# Altium schematic sheet 03_CONNECTORS & AUDIO CONTROL INPUTS.SchDoc
size A4
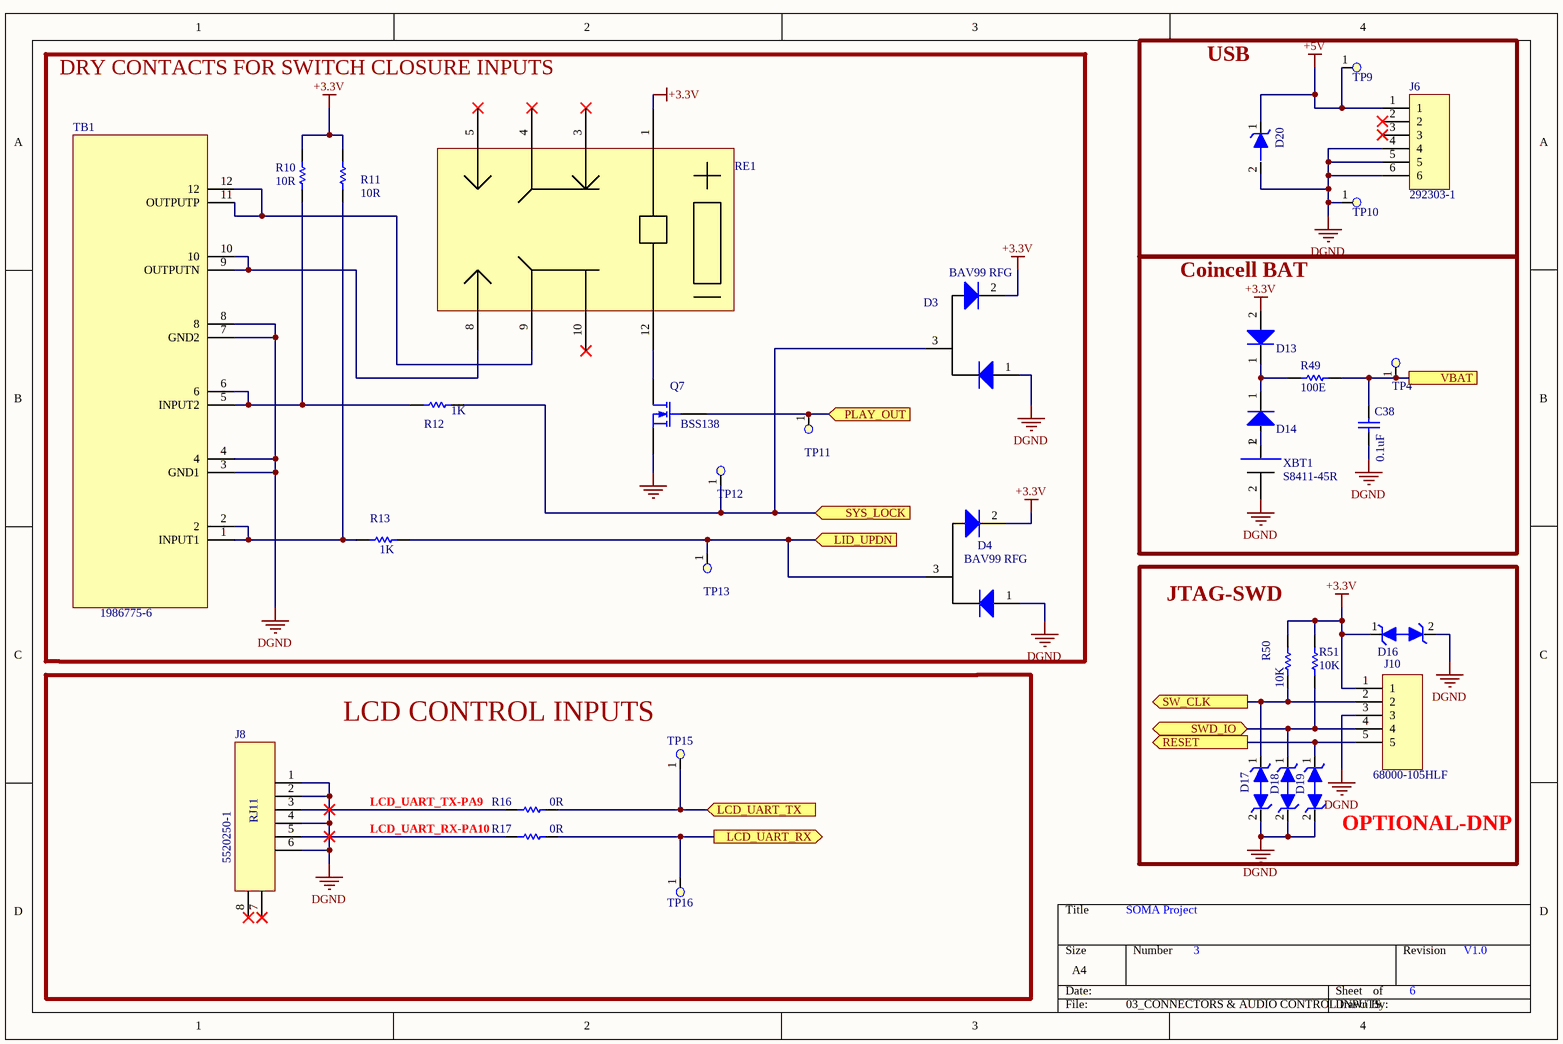
[diagram p0: 03_CONNECTORS & AUDIO CONTROL INPUTS.SchDoc]

## Parts
C38  0.1uF  [C0603]
D3  value BAV99 RFG  [SOT95P240X130-3N]  (hidden comment: DIODE ARRAY GP 70V 200MA SOT23)
D4  value BAV99 RFG  [SOT95P240X130-3N]  (hidden comment: DIODE ARRAY GP 70V 200MA SOT23)
D13  DIODE SCHOTTKY 30V 200MA SOD123  [SOD3715X140N_2A]  (value not drawn)
D14  DIODE SCHOTTKY 30V 200MA SOD123  [SOD3715X140N_2A]  (value not drawn)
D16  TVS DIODE 3.3VWM 11.5VC SOD923  [SOD1006X40N_BI]  (value not drawn)
D17  TVS DIODE 3.3VWM 11.5VC SOD923  [SOD1006X40N_BI]  (value not drawn)
D18  TVS DIODE 3.3VWM 11.5VC SOD923  [SOD1006X40N_BI]  (value not drawn)
D19  TVS DIODE 3.3VWM 11.5VC SOD923  [SOD1006X40N_BI]  (value not drawn)
D20  TVS DIODE 5VWM 12VC SOD723  [SOD1460X65N_2A]  (value not drawn)
J6  value 292303-1  [TE_292303-1]  (hidden comment: CONN RCPT USB2.0 TYPEA 4POS R/A)
J8  Manufacturer Part Number: 5520250-1  [TE_5520250-1]  (hidden comment: CONN MOD JACK 6P2C R/A UNSHLD)
J10  value 68000-105HLF  [BERG_1X5]  (hidden comment: CONN HEADER VERT 5POS 2.54MM)
Q7  value BSS138  [SOT95P240X110-3N]  (hidden comment: MOSFET N-CH 50V 220MA SOT23-3)
R10  value 10R  [R0402]  (hidden comment: RES SMD 10 OHM 5% 1/16W 0402)
R11  value 10R  [R0402]  (hidden comment: RES SMD 10 OHM 5% 1/16W 0402)
R12  value 1K  [R0402]  (hidden comment: RES SMD 1K OHM 1% 1/16W 0402)
R13  value 1K  [R0402]  (hidden comment: RES SMD 1K OHM 1% 1/16W 0402)
R16  value 0R  [R0402]  (hidden comment: RES SMD 0 OHM JUMPER 1/16W 0402)
R17  value 0R  [R0402]  (hidden comment: RES SMD 0 OHM JUMPER 1/16W 0402)
R49  100E  [R0402]
R50  10K  [R0402]
R51  10K  [R0402]
RE1  RELAY GEN PURPOSE DPDT 1A 3VDC  [RELAY_TXS2SA-3V]  (value not drawn)
TB1  Manufacturer Part Number: 1986775-6  [TE_1986775-6]  (hidden comment: TERM BLK 6P SIDE ENT 5.08MM PCB)
TP4  Test Point,1.6mm Diameter,SMD  [TP_63C]  (value not drawn)  (no BOM)
TP9  Test Point,1.6mm Diameter,SMD  [TP_63C]  (value not drawn)  (no BOM)
TP10  Test Point,1.6mm Diameter,SMD  [TP_63C]  (value not drawn)  (no BOM)
TP11  Test Point,1.6mm Diameter,SMD  [TP_63C]  (value not drawn)  (no BOM)
TP12  Test Point,1.6mm Diameter,SMD  [TP_63C]  (value not drawn)  (no BOM)
TP13  Test Point,1.6mm Diameter,SMD  [TP_63C]  (value not drawn)  (no BOM)
TP15  Test Point,1.6mm Diameter,SMD  [TP_63C]  (value not drawn)  (no BOM)
TP16  Test Point,1.6mm Diameter,SMD  [TP_63C]  (value not drawn)  (no BOM)
XBT1  Manufacturer part Number: S8411-45R  [HLDR_S8411-45R]  (hidden comment: BATTERY HOLDER COIN 12MM SMD)

## Blocks framed on the sheet
DRY CONTACTS FOR SWITCH CLOSURE INPUTS: D3 D4 Q7 R10-R13 RE1 TB1 TP11-TP13
USB: D20 J6 TP9 TP10
Coincell BAT: C38 D13 D14 R49 TP4 XBT1
LCD CONTROL INPUTS: J8 R16 R17 TP15 TP16

## Ports
LCD_UART_RX (out), LCD_UART_TX (in), LID_UPDN (in), PLAY_OUT (in), RESET (out), SW_CLK (out), SWD_IO (bidir), SYS_LOCK (in), VBAT

## Nets
+3.3V: D3.2(K) D4.2(K) D13.2(A) D16.1(K) J10.1 R10.2 R11.2 R50.2 R51.2 RE1.1
+5V: D20.1(K) J6.1 TP9.1
DGND: C38.1 D3.1(A) D4.1(A) D16.2(A) D17.2(A) D18.2(A) D19.2(A) D20.2(A) J6.4 J6.5 J6.6 J8.1 J8.2 J8.4 J8.6 J10.3 TB1.3(GND1) TB1.4 TB1.7(GND2) TB1.8 TP10.1 XBT1.2(-)
GND: Q7.2(S)
LCD_UART_RX: R17.2 TP16.1 ; port LCD_UART_RX
LCD_UART_RX-PA10: J8.5 R17.1
LCD_UART_TX: R16.2 TP15.1 ; port LCD_UART_TX
LCD_UART_TX-PA9: J8.3 R16.1
LID_UPDN: D4.3(AK) R13.2 TP13.1 ; port LID_UPDN
PLAY_OUT: Q7.1(G) TP11.1 ; port PLAY_OUT
RESET: D19.1(K) J10.5 ; port RESET
SW_CLK: D17.1(K) J10.2 R50.1 ; port SW_CLK
SWD_IO: D18.1(K) J10.4 R51.1 ; port SWD_IO
SYS_LOCK: D3.3(AK) R12.2 TP12.1 ; port SYS_LOCK
VBAT: C38.2 R49.2 TP4.1 ; port VBAT
NetD13_1: D13.1(K) D14.1(K) R49.1
NetD14_2: D14.2(A) XBT1.1(+)
NetQ7_3: Q7.3(D) RE1.12
NetR10_1: R10.1 R12.1 TB1.5(INPUT2) TB1.6
NetR11_1: R11.1 R13.1 TB1.1(INPUT1) TB1.2
NetRE1_8: RE1.8 TB1.9(OUTPUTN) TB1.10
NetRE1_9: RE1.9 TB1.11(OUTPUTP) TB1.12

Not connected (* = marked no-connect by the designer): J6 2* 3*; J8 7* 8*; RE1 3* 4* 5* 10*

## Notes on the sheet
- JTAG-SWD
- (near D19) OPTIONAL-DNP
- SOMA Project
- 3
- 6
- V1.0
- (in symbol CONN MOD JACK 6P2C R/A UNSHLD) RJ11

## Library data of the parts
C38 = CAP CER 0.1UF 10V X7R 0603: Manufacturer: Würth Elektronik; Manufacturer part Number: 885012206020; Tolerance: ±10%; Operating Temperature: -55°C ~ 125°C; Reference link: https://www.digikey.com/en/products/detail/w%C3%BCrth-elektronik/885012206020/5453794; Package: 0603 (1608 Metric); Distributor: Digikey; Distributor part Number: 732-7939-1-ND; Type: CAP; Unit Price: $0.10000; Value: 0.1uF; Rating: 10V
D3 D4 = DIODE ARRAY GP 70V 200MA SOT23: Diode Array 1 Pair Series Connection Standard 70V 200mA Surface Mount TO-236-3, SC-59, SOT-23-3; Manufacturer: Taiwan Semiconductor Corporation; Type: Diodes - Rectifiers - Arrays; Operating Temperature: -55°C ~ 150°C; Package: TO-236-3, SC-59, SOT-23-3; Distributor: Digi-key; Reference link: https://www.digikey.in/product-detail/en/taiwan-semiconductor-corporation/BAV99-RFG/BAV99RFGTR-ND/7374190; Distributor part Number: BAV99RFGTR-ND; Unit Price: 2.46926; Rating: 70V 200mA; Part Status: Active
D13 D14 = DIODE SCHOTTKY 30V 200MA SOD123: Manufacturer: Diodes Incorporated; Manufacturer part Number: BAT43W-7-F; Value: 30 V 200mA (DC); Type: Schottky Diode; Rating: 1 V @ 200 mA; Tolerance: NA; Operating Temperature: -55°C ~ 125°C; Package: SOD-123; Reference link: https://www.digikey.com/en/products/detail/diodes-incorporated/BAT43W-7-F/749953; Distributor: Digikey; Distributor part Number: BAT43W-FDICT-ND; Unit Price: $0.50000
D16-D19 = TVS DIODE 3.3VWM 11.5VC SOD923: 11.5V Clamp 2A (8/20µs) Ipp Tvs Diode Surface Mount SOD-923; Manufacturer Part Number: ESD9B3.3ST5G; Manufacturer: ON Semiconductor; Value: 3.3V 11.5V; Assembly Option: DNP; Tolerance: NA; Operating Temperature: -55°C to +150°C; Distributor: Digikey; Distributor part Number: ESD9B3.3ST5GOSTR-ND; Package: SOD-923; Rating: 3.3V 11.5V; Reference link: https://www.digikey.com/product-detail/en/on-semiconductor/ESD9B3.3ST5G/ESD9B3.3ST5GOSTR-ND/1973669; Type: TVS; Unit Price: $0.24000
D20 = SP1003-01DTG: Manufacturer: Littelfuse Inc.; Value: 12V (Typ) Clamp 7A (8/20µs; Tolerance: NA; Type: IC; Manufacturer Part Number: SP1003-01DTG; Operating Temperature: -40°C ~ 125°C (TJ); Distributor: Mouser; Distributor part Number: 576-SP1003-01DTG; Package: SOD-723-2; Reference link: https://www.mouser.in/ProductDetail/Littelfuse/SP1003-01DTG?qs=Xb8IjHhkxj76JbYOs4IgRA%3D%3D
J6 = CONN RCPT USB2.0 TYPEA 4POS R/A: Manufacturer: TE Connectivity AMP Connectors; Rating: 30VAC, 1A per Contact; Tolerance: NA; Unit Price: $1.68000; Distributor: Digikey; Distributor part Number: A31726-ND; Manufacturer part Number: 292303-1; Reference link: https://www.digikey.com/en/products/detail/te-connectivity-amp-connectors/292303-1/773786; Type: USB-A (USB TYPE A)
J8 = CONN MOD JACK 6P2C R/A UNSHLD: Jack Modular Connector 6p2c (RJ11) 90° Angle (Right) Unshielded Cat3; Manufacturer: TE Connectivity AMP Connectors; Category: Modular Connectors - Jacks; Part Status: Active; Connector Type: Jack; Number of Positions/Contacts: 6p2c (RJ11); Mounting Type: Through Hole; Operating Temperature: -40°C ~ 85°C; Packaging: Tray; Distributor: Digikey; Distributor Part Number: A31404-ND; Reference Link: https://www.digikey.in/product-detail/en/te-connectivity-amp-connectors/5520250-1/A31404-ND/769548; Ratings: Cat3; Unit Price: 111.90000
J10 = CONN HEADER VERT 5POS 2.54MM: Manufacturer: Amphenol ICC (FCI); Rating: UL94 V-0; Tolerance: NA; Unit Price: $0.48000; Distributor: Digikey; Distributor part Number: 609-3462-ND; Manufacturer part Number: 68000-105HLF; Package: Bag; Reference link: https://www.digikey.com/en/products/detail/amphenol-icc-fci/68000-105HLF/2023304; Type: Header
Q7 = MOSFET N-CH 50V 220MA SOT23-3: N-Channel 50V 220mA (Ta) 360mW (Ta) Surface Mount SOT-23-3; Manufacturer: ON Semiconductor; Tolerance: NA; Type: N-Channel MOSFET; Unit Price: 20.89000; Distributor: Digikey; Distributor part Number: BSS138CT-ND; Manufacturer part Number: BSS138; Package: TO-236-3, SC-59, SOT-23-3; Rating: 50V 220mA; Reference link: https://www.digikey.in/product-detail/en/on-semiconductor/BSS138/BSS138CT-ND/244294
R10 R11 = RES SMD 10 OHM 5% 1/16W 0402: 10 Ohms ±5% 0.063W, 1/16W Chip Resistor 0402 (1005 Metric) Automotive AEC-Q200 Thick Film; Manufacturer: Vishay Dale; Manufacturer part Number: CRCW040210R0JNED; Rating: AEC-Q200  0.063W, 1/16W; Tolerance: ±5%; Distributor: Digikey; Package: 0402 (1005 Metric); Operating Temperature: -55°C ~ 155°C; Type: RES; Distributor part Number: 541-10JCT-ND; Reference link: https://www.digikey.com/en/products/detail/vishay-dale/CRCW040210R0JNED/1177520; Unit Price: $0.10000
R12 R13 = RES SMD 1K OHM 1% 1/16W 0402: Manufacturer: Yageo; Manufacturer part Number: AC0402FR-071KL; Rating: 0.063W, 1/16W; Tolerance: ±1%; Distributor: Digikey; Distributor part Number: 311-1KLBCT-ND; Unit Price: $0.10000; Reference link: https://www.digikey.com/en/products/detail/yageo/AC0402FR-071KL/2827801; Type: RES; Package: 0402 (1005 Metric); Part Status: Active; Operating Temperature: -55°C ~ 155°C; Size / Dimension: 0.039" L x 0.020" W (1.00mm x 0.50mm)
R16 R17 = RES SMD 0 OHM JUMPER 1/16W 0402: 0 Ohms Jumper 0.063W, 1/16W Chip Resistor 0402 (1005 Metric) Moisture Resistant Thick Film; Manufacturer: Yageo; Manufacturer part Number: RC0402JR-070RP; Distributor: Digikey; Distributor part Number: YAG1279TR-ND; Unit Price: 0.00377; Reference link: https://www.digikey.sg/product-detail/en/yageo/RC0402JR-070RP/YAG1279TR-ND/4935294; Type: RES; Rating: 0.063W, 1/16W; Package: 0402 (1005 Metric); Tolerance: Jumper; Part Status: Active; Operating Temperature: -55°C ~ 155°C; Size / Dimension: 0.039" L x 0.020" W (1.00mm x 0.50mm)
R49 = RES SMD 100 OHM 1% 1/10W 0402: 100 Ohms ±1% 0.1W, 1/10W Chip Resistor 0402 (1005 Metric) Automotive AEC-Q200 Thick Film; Manufacturer: Panasonic Electronic Components; Manufacturer part Number: ERJ-2RKF1000X; Operating Temperature: -55°C ~ 155°C; Distributor: Digikey; Package: 0402; Type: RES; Distributor part Number: P100LCT-ND; Rating: 1/10W; Reference link: https://www.digikey.in/product-detail/en/panasonic-electronic-components/ERJ-2RKF1000X/P100LCT-ND/194126; Tolerance: ±1%; Value: 100E; Unit Price: 7.46000
R50 R51 = RES SMD 10K OHM 1% 1/10W 0402: 10 kOhms ±1% 0.1W, 1/10W Chip Resistor 0402 (1005 Metric) Automotive AEC-Q200 Thick Film; Manufacturer: Panasonic Electronic Components; Manufacturer part Number: ERJ-2RKF1002X; Operating Temperature: -55°C ~ 155°C; Reference link: https://www.digikey.in/product-detail/en/panasonic-electronic-components/ERJ-2RKF1002X/P10.0KLCT-ND/194119; Distributor: Digikey; Distributor part Number: P10.0KLCT-ND; Package: 0402; Type: RES; Rating: 1/10W; Cost: 0.00715; Tolerance: ±1%; Value: 10K
RE1 = RELAY GEN PURPOSE DPDT 1A 3VDC: General Purpose Relay DPDT (2 Form C) Surface Mount; Manufacturer: Panasonic Electric Works; Manufacturer Part Number: TXS2SA-3V; Rating: 3VDC 1A; Coil Resistance: 180 Ohms; Distributor: Digikey; Distributor Part Number: 255-2341-5-ND; Unit Price: $4.65000; Packaging: Tube; Operating Temperature: -40°C ~ 70°C; Type: Signal Relays, Up to 2 Amps; Reference Link: https://www.digikey.com/en/products/detail/panasonic-electric-works/TXS2SA-3V/650160
TB1 = TERM BLK 6P SIDE ENT 5.08MM PCB: 6 Position Wire to Board Terminal Block Horizontal with Board 0.200" (5.08mm) Through Hole; Manufacturer: TE Connectivity AMP Connectors; Wire Gauge: 12 AWG; Rating: 300V  15A; Category: Terminal Blocks - Wire to Board; Package: Tray; Part Status: Active; Mounting Type: Through Hole; Operating Temperature: -40°C ~ 110°C; Distributor: Digikey; Distributor Part Number: A120496-ND; Unit Price: 349.87000
XBT1 = BATTERY HOLDER COIN 12MM SMD: Manufacturer: Harwin Inc.; Distributor: Digikey; Distributor part Number: 952-1745-1-ND; Unit Price: $1.39000; Reference link: https://www.digikey.com/en/products/detail/harwin-inc/S8411-45R/3131055; Type: Coin Cell, Holder; Package: Cut Tape (CT; Part Status: Active; Operating Temperature: -55°C ~ 105°C
TP4 TP9-TP13 TP15 TP16 = Test Point,1.6mm Diameter,SMD: AEMCI Part Number: *; Vendor: *; Vendor ID: *